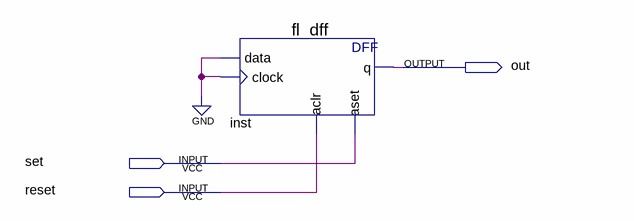
[diagram p0: schematic sheet]
// Quartus schematic Flag.bdf as structural Verilog: 1 symbols, 3 pins
module Flag (
  input  set,
  input  reset,
  output out
);

  fl_dff inst (.data(1'b0), .clock(1'b0), .aclr(reset), .aset(set), .q(out));
endmodule
